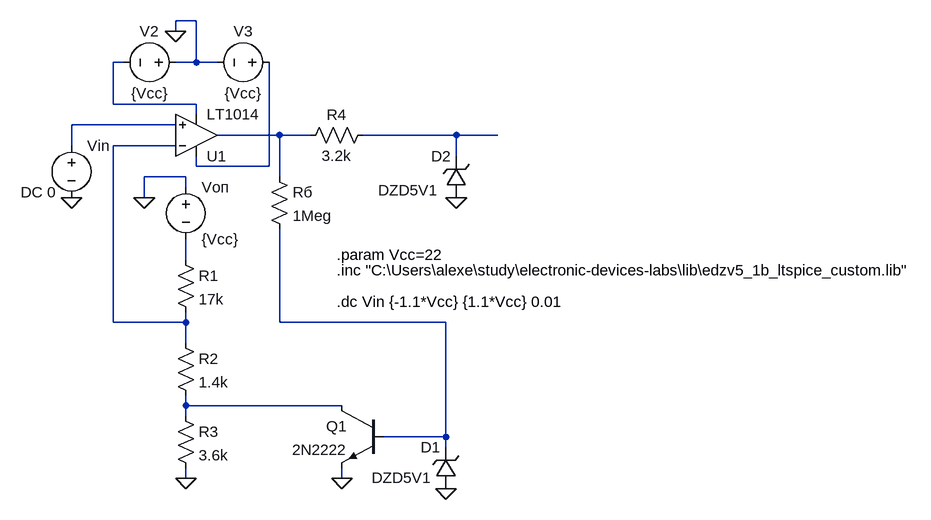
[diagram p0: schematic scheme10.asc]
scheme10.asc, the LTspice schematic file:
Version 4.1
SHEET 1 1440 804
WIRE 224 -32 192 -32
WIRE 192 -16 192 -32
WIRE 112 32 96 32
WIRE 224 32 224 -32
WIRE 224 32 192 32
WIRE 256 32 224 32
WIRE 96 96 96 32
WIRE 224 96 96 96
WIRE 224 112 224 96
WIRE 192 128 32 128
WIRE 352 144 256 144
WIRE 400 144 352 144
WIRE 624 144 480 144
WIRE 688 144 624 144
WIRE 32 160 32 128
WIRE 192 160 96 160
WIRE 624 176 624 144
WIRE 224 192 224 176
WIRE 336 192 336 32
WIRE 336 192 224 192
WIRE 208 208 144 208
WIRE 352 208 352 144
WIRE 208 224 208 208
WIRE 144 240 144 208
WIRE 208 336 208 304
WIRE 96 432 96 160
WIRE 208 432 208 416
WIRE 208 432 96 432
WIRE 352 432 352 288
WIRE 608 432 352 432
WIRE 208 464 208 432
WIRE 208 560 208 544
WIRE 448 560 208 560
WIRE 208 576 208 560
WIRE 608 608 608 432
WIRE 608 608 512 608
WIRE 608 624 608 608
WIRE 208 672 208 656
WIRE 448 672 448 656
FLAG 624 240 0
FLAG 608 688 0
FLAG 448 672 0
FLAG 208 672 0
FLAG 32 240 0
FLAG 144 240 0
FLAG 192 -16 0
SYMBOL OpAmps\\LT1014 224 208 M180
SYMATTR InstName U1
SYMBOL voltage 208 208 R0
SYMATTR InstName Vоп
SYMATTR Value {Vcc}
SYMBOL res 192 320 R0
SYMATTR InstName R1
SYMATTR Value 17k
SYMBOL res 192 448 R0
SYMATTR InstName R2
SYMATTR Value 1.4k
SYMBOL res 192 560 R0
SYMATTR InstName R3
SYMATTR Value 3.6k
SYMBOL res 496 128 R90
WINDOW 0 0 56 VBottom 2
WINDOW 3 32 56 VTop 2
SYMATTR InstName R4
SYMATTR Value 3.2k
SYMBOL res 336 192 R0
SYMATTR InstName Rб
SYMATTR Value 1Meg
SYMBOL zener 640 240 R180
WINDOW 0 24 64 Left 2
WINDOW 3 44 11 Left 2
SYMATTR InstName D2
SYMATTR Value DZD5V1
SYMBOL zener 624 688 R180
WINDOW 0 24 64 Left 2
WINDOW 3 38 17 Left 2
SYMATTR InstName D1
SYMATTR Value DZD5V1
SYMBOL npn 512 560 M0
SYMATTR InstName Q1
SYMATTR Value 2N2222
SYMBOL voltage 32 144 R0
WINDOW 3 -78 88 Left 2
SYMATTR InstName Vin
SYMATTR Value DC 0
SYMBOL voltage 208 32 R90
WINDOW 0 -32 56 VBottom 2
WINDOW 3 32 56 VTop 2
SYMATTR InstName V2
SYMATTR Value {Vcc}
SYMBOL voltage 352 32 R90
WINDOW 0 -32 56 VBottom 2
WINDOW 3 32 56 VTop 2
SYMATTR InstName V3
SYMATTR Value {Vcc}
TEXT 440 328 Left 2 !.param Vcc=22
TEXT 440 400 Left 2 !.dc Vin {-1.1*Vcc} {1.1*Vcc} 0.01
TEXT 440 352 Left 2 !.inc "C:\\Users\\alexe\\study\\electronic-devices-labs\\lib\\edzv5_1b_ltspice_custom.lib"

The netlist it stands for:
* scheme10.asc
X§U1 N002 N005 N006 N001 N003 LT1014  ; pins In+ In- V+ V- OUT
Vоп 0 N007 {Vcc}
R1 N007 N005 17k
R2 N005 N009 1.4k
R3 N009 0 3.6k
R4 N004 N003 3.2k
Rб N003 N008 1Meg
D2 0 N004 DZD5V1
D1 0 N008 DZD5V1
Q1 N009 N008 0 0 2N2222
Vin N002 0 DC 0
V2 0 N001 {Vcc}
V3 N006 0 {Vcc}
.model D D
.lib standard.dio
.model NPN NPN
.model PNP PNP
.lib standard.bjt
.param Vcc=22
.dc Vin {-1.1*Vcc} {1.1*Vcc} 0.01
.inc "C:\Users\alexe\study\electronic-devices-labs\lib\edzv5_1b_ltspice_custom.lib"
.backanno
.end